# Altium schematic sheet Instrumentation Amplifier Design.SchDoc: Instrumentation Amplifier Design
size A4; DocumentNumber: GPH-3110-5; Revision: 1; SheetNumber: 2; SheetTotal: 6
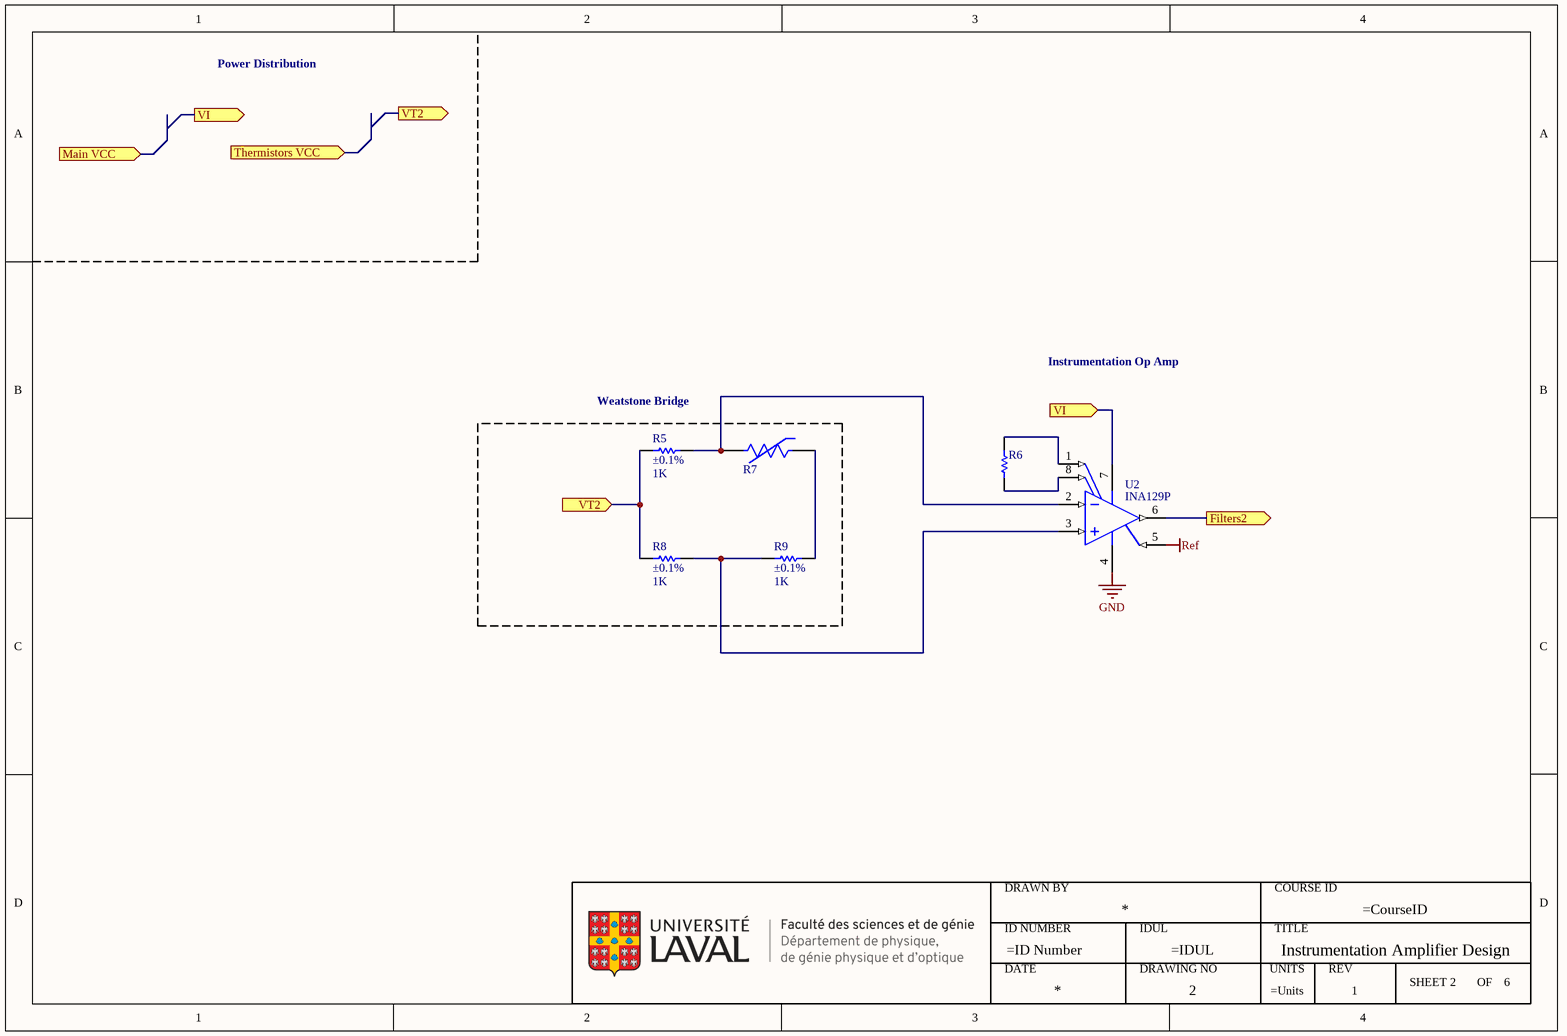
[diagram p0: Instrumentation Amplifier Design.SchDoc]

## Parts
*2  ULaval FSG-DPGPO  (value not drawn)
R5  value 1K  TC: ±0.1%  (hidden comment: Resistor)
R6  Resistor  (value not drawn)
R7  TMP6131DYAT  [FP-DYA0002A-MFG]  (value not drawn)
R8  value 1K  TC: ±0.1%  (hidden comment: Resistor)
R9  value 1K  TC: ±0.1%  (hidden comment: Resistor)
U2  INA129P  [P0008A]

## Blocks framed on the sheet
Weatstone Bridge: R5 R7-R9

## Ports
Filters2 (out), Main VCC (in), Thermistors VCC (in), VI (in), VI (out), VT2 (in), VT2 (out)

## Nets
GND: U2.4(V-)
Ref: U2.5(REF)
Filters2: U2.6(VO) ; port Filters2
VI: U2.7(V+) ; port VI
VT2: R5.2 R8.2 ; port VT2
NetR5_1: R5.1 R7.1(-) U2.2(VIN-)
NetR6_1: R6.1 U2.8(RG)
NetR6_2: R6.2 U2.1(RG)
NetR7_2: R7.2(+) R9.1
NetR8_1: R8.1 R9.2 U2.3(VIN+)

## Notes on the sheet
- Power Distribution
- Instrumentation Op Amp
- (in symbol ULaval FSG-DPGPO) DRAWN BY; COURSE ID; ID NUMBER; IDUL; TITLE; DATE; DRAWING NO; UNITS; REV; SHEET; OF

## Library data of the parts
R5 R8 R9 = Resistor: TC1: 0; SimulationGenericComponent: True; TC2: 0
R6 = Resistor: TC1: 0; SimulationGenericComponent: True; Value: 1K; TC2: 0
R7 = CMP-009-00177-1: ±1% tolerance 10kΩ linear thermistor available in 0402 and 0603 package options 2-SOT-5X3 -40 to 125; Max Operating Temperature: 125°C; Mounting Technology: Surface Mount; Min Operating Temperature: -40°C; Series: -; Resistance Tolerance: 1%
U2 = CMP-014-00009-1: Precision, Low Power Instrumentation Amplifiers 8-PDIP; Common Mode Rejection Ratio: 120dB; Supply Current: 750uA; -3db Bandwidth: 1.3MHz; Input Bias Current: 5nA; Output Current per Channel: 15mA; Number of Channels: 1; Input Voltage Noise Density: 8nV/sqrt Hz; Input Resistance: 100GR; Voltage Gain: 80dB; Number of Elements: 3; Dual Supply Voltage: 15V; Slew Rate: 4V/µs; Min Dual Supply Voltage: 2.25V; Max Dual Supply Voltage: 18V; Operating Supply Current: 700uA; Min Supply Voltage: 4.5V; Input Offset Voltage (Vos): 50uV; Max Supply Voltage: 36V; RoHS Compliant: Yes; Min Operating Temperature: -40°C; Gain Bandwidth Product: 1.3MHz; Weight: 0.018646oz; Length: 9.81mm; Width: 6.35mm; Series: INA129; Pins: 8; Max Operating Temperature: 125°C; Number of Amplifiers: 1; Nominal Supply Current: 750uA; Packaging: Rail/Tube; Bandwidth: 1.3MHz; Height: 4.57mm; Case/Package: P; Lead Free: Lead Free; Quiescent Current: 700uA; Reach SVHC Compliant: Yes; Package Quantity: 50; Number of Circuits: 1; Radiation Hardening: No